# Altium schematic sheet DVT-Discrete-1.SchDoc
size A4
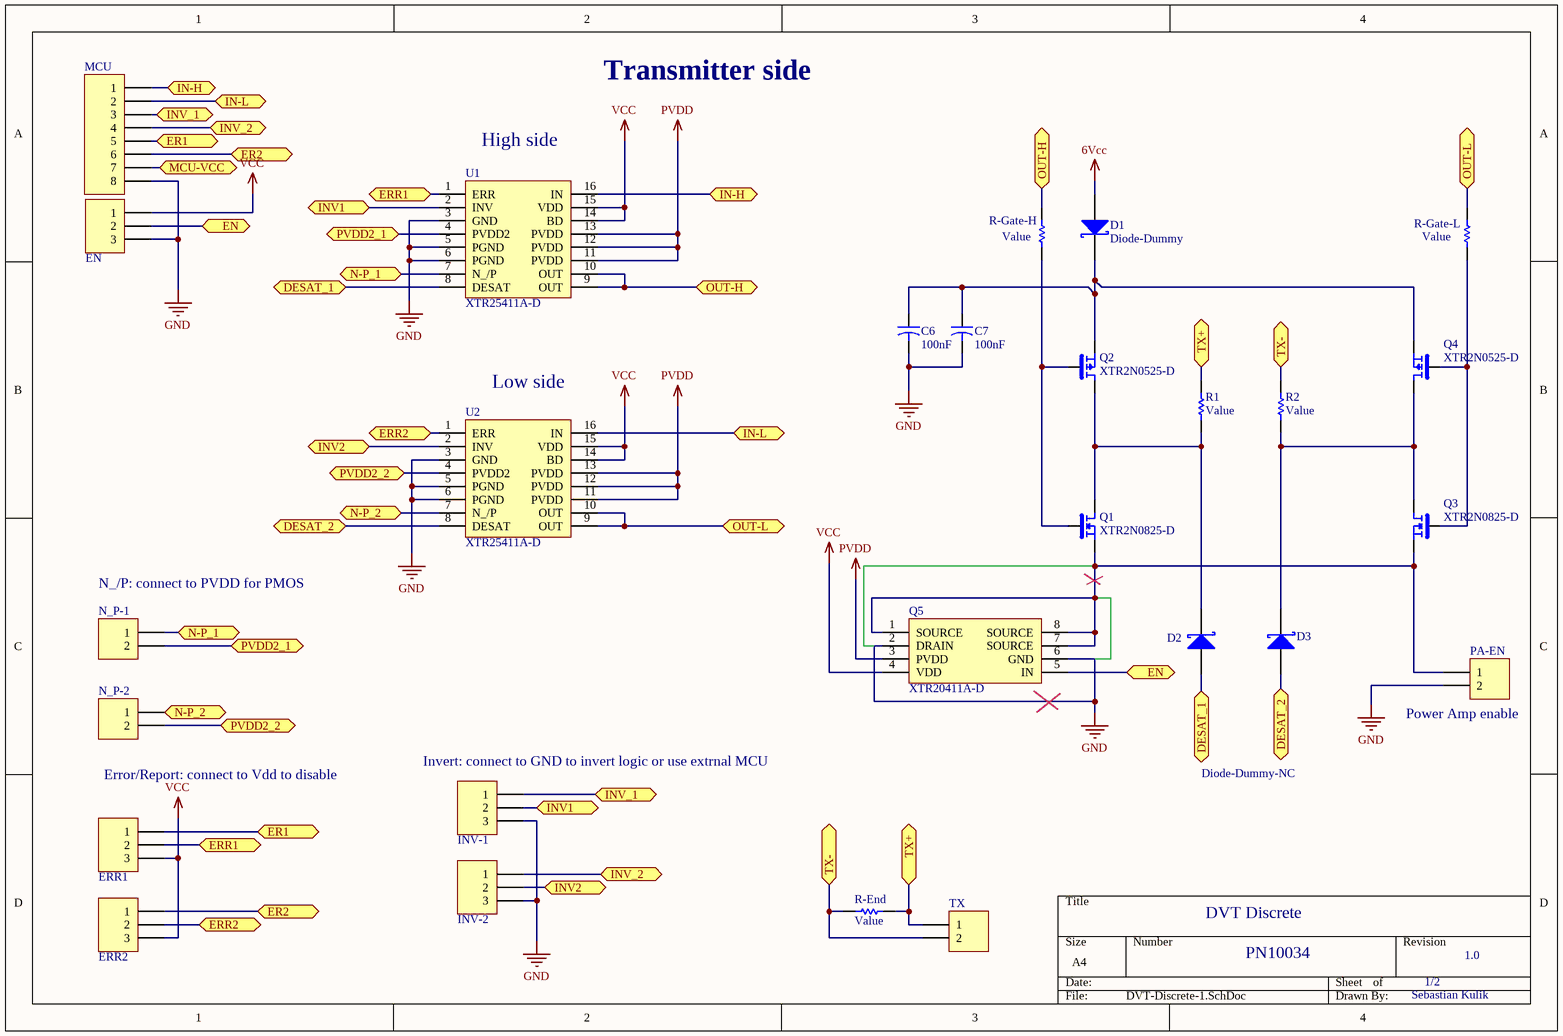
[diagram p0: DVT-Discrete-1.SchDoc]

## Parts
C6  value 100nF  [Dummy-10mm]  (hidden comment: Capacitor-Dummy-THT)
C7  value 100nF  [Dummy-10mm]  (hidden comment: Capacitor-Dummy-THT)
D1  Diode-Dummy  [DO-15-Dummy]
D2  Diode-Dummy-NC  [DO-15-Dummy]
D3  Diode-Dummy  [DO-15-Dummy]  (value not drawn)
EN  Plug_3_90_2.54  [HDR1X3]  (value not drawn)
ERR1  Plug_3_90_2.54  [HDR1X3]  (value not drawn)
ERR2  Plug_3_90_2.54  [HDR1X3]  (value not drawn)
INV-1  Plug_3_90_2.54  [HDR1X3]  (value not drawn)
INV-2  Plug_3_90_2.54  [HDR1X3]  (value not drawn)
MCU  Plug_08_2.54  [HDR1X8_2.54]  (value not drawn)
N_P-1  Plug_2_90_2.54  [HDR1X2]  (value not drawn)
N_P-2  Plug_2_90_2.54  [HDR1X2]  (value not drawn)
PA-EN  Plug_2_90_2.54  [HDR1X2]  (value not drawn)
Q1  XTR2N0825-D  [DIP-8-Ceramic-HT]
Q2  XTR2N0525-D  [DIP-8-Ceramic-HT]
Q3  XTR2N0825-D  [DIP-8-Ceramic-HT]
Q4  XTR2N0525-D  [DIP-8-Ceramic-HT]
Q5  XTR20411A-D  [DIP-8-Ceramic-HT]
R1  Resistor-Dummy-THT  [Dummy-15mm]  (value not drawn)
R2  Resistor-Dummy-THT  [Dummy-15mm]  (value not drawn)
R-End  Resistor-Dummy-THT  [Dummy-10mm]  (value not drawn)
R-Gate-H  Resistor-Dummy-THT  [Dummy-10mm]  (value not drawn)
R-Gate-L  Resistor-Dummy-THT  [Dummy-10mm]  (value not drawn)
TX  PHOENIX_1715721  [Phoenix-2-5_08]  (value not drawn)
U1  XTR25411A-D  [DIP-16-Ceramic-HT]
U2  XTR25411A-D  [DIP-16-Ceramic-HT]

## Ports
DESAT_1, DESAT_2, EN, ER1, ER2, ERR1, ERR2, IN-H, IN-L, INV1, INV2, INV_1, INV_2, MCU-VCC, N-P_1, N-P_2, OUT-H, OUT-L, PVDD2_1, PVDD2_2, TX+, TX-

## Nets
6Vcc: D1.2(A)
GND: C6.2 C7.2 EN.3 INV-1.3 INV-2.3 MCU.8 PA-EN.2 Q5.2(DRAIN) Q5.6(GND) U1.3(GND) U1.5(PGND) U1.6(PGND) U2.3(GND) U2.5(PGND) U2.6(PGND)
PVDD: Q5.3(PVDD) U1.11(PVDD) U1.12(PVDD) U1.13(PVDD) U2.11(PVDD) U2.12(PVDD) U2.13(PVDD)
VCC: EN.1 ERR1.3 ERR2.3 Q5.4(VDD) U1.14(BD) U1.15(VDD) U2.14(BD) U2.15(VDD)
DESAT_1: D2.2(A) U1.8(DESAT) ; port DESAT_1
DESAT_2: D3.2(A) U2.8(DESAT) ; port DESAT_2
EN: EN.2 Q5.5(IN) ; port EN
ER1: ERR1.1 MCU.5 ; port ER1
ER2: ERR2.1 MCU.6 ; port ER2
ERR1: ERR1.2 U1.1(ERR) ; port ERR1
ERR2: ERR2.2 U2.1(ERR) ; port ERR2
IN-H: MCU.1 U1.16(IN) ; port IN-H
IN-L: MCU.2 U2.16(IN) ; port IN-L
INV1: INV-1.2 U1.2(INV) ; port INV1
INV2: INV-2.2 U2.2(INV) ; port INV2
INV_1: INV-1.1 MCU.3 ; port INV_1
INV_2: INV-2.1 MCU.4 ; port INV_2
MCU-VCC: MCU.7 ; port MCU-VCC
N-P_1: N_P-1.1 U1.7(N_/P) ; port N-P_1
N-P_2: N_P-2.1 U2.7(N_/P) ; port N-P_2
OUT-H: R-Gate-H.2 U1.9(OUT) U1.10(OUT) ; port OUT-H
OUT-L: R-Gate-L.2 U2.9(OUT) U2.10(OUT) ; port OUT-L
PVDD2_1: N_P-1.2 U1.4(PVDD2) ; port PVDD2_1
PVDD2_2: N_P-2.2 U2.4(PVDD2) ; port PVDD2_2
TX+: R1.2 R-End.2 TX.1 ; port TX+
TX-: R2.2 R-End.1 TX.2 ; port TX-
NetC6_1: C6.1 C7.1 D1.1(K) Q2.1(Source) Q4.1(Source)
NetD2_1: D2.1(K) Q1.5(Drain) Q2.5(Drain) R1.1
NetD3_1: D3.1(K) Q3.5(Drain) Q4.5(Drain) R2.1
NetPA-EN_1: PA-EN.1 Q1.1(Source) Q3.1(Source) Q5.1(SOURCE) Q5.7(SOURCE) Q5.8(SOURCE)
NetQ1_4: Q1.4(Gate) Q2.4(Gate) R-Gate-H.1
NetQ3_4: Q3.4(Gate) Q4.4(Gate) R-Gate-L.1

## Notes on the sheet
- Transmitter side
- (near U1) High side
- (near U2) Low side
- (near N_P-1) N_/P: connect to PVDD for PMOS
- (near PA-EN) Power Amp enable
- Error/Report: connect to Vdd to disable
- (near INV-1) Invert: connect to GND to invert logic or use extrnal MCU
- DVT Discrete
- PN10034
- 1/2
- 1.0
- Sebastian Kulik

## Library data of the parts
C6 C7 = Capacitor-Dummy-THT: Deliverer PartNr: 699-5027; Manufacturer: AVX; Manufacturer PartNr: SR205E104MARTR; Deliverer: RS; Published: 08.12.2015; Part Description: Capacitor-Dummy-THT; Publisher: Sebastian Kulik; PackageDescription: -; TDE-PN: -
D1-D3 = Diode-Dummy: Manufacturer PartNr: SB5100E-G; Deliverer PartNr: 906-6762; Manufacturer: COMCHIP TECHNOLOGY; Deliverer: RS; Published: 09.12.2015; TDE-PN: -; Publisher: Sebastian Kulik; PackageDescription: DO-201AD
EN = Plug_3_90_2.54: Plug,-3-Pin; Manufacturer PartNr: 61300311021; Manufacturer: WE; Deliverer PartNr: 2356177; Deliverer: Farnell; TDE-PN: CON0011; Publisher: Sebastian Kulik
ERR1 ERR2 INV-1 INV-2 = Plug_3_90_2.54: Plug,-3-Pin; Manufacturer: WE; Manufacturer PartNr: 61300311021; Deliverer PartNr: 2356177; Deliverer: Farnell; TDE-PN: CON0011; Publisher: Sebastian Kulik
MCU = Plug_08_2.54: Plug, 08-Pin; Manufacturer PartNr: 61300811121; Manufacturer: WE; TDE-PN: CON0035; LatestRevisionDate: 11.11.2014; LatestRevisionNote: Re-released for DXP Platform.; Publisher: Sebastian Kulik; Deliverer: WE; Deliverer PartNr: 61300811121
N_P-1 N_P-2 PA-EN = Plug_2_90_2.54: Plug, 2-Pin; Manufacturer PartNr: 61300211021; Manufacturer: WE; Deliverer PartNr: 2356176; Deliverer: Farnell; TDE-PN: CON0010; LatestRevisionDate: 14.05.2014; LatestRevisionNote: Re-released for DXP Platform.; Publisher: Sebastian Kulik
Q1 Q3 = XTR2N0825-D: N-FET, 80V@ 4A; Manufacturer: TI; TDE-PN: DIS0043; Deliverer: ProTEc; Published: 09.12.2015; Publisher: Sebastian Kulik; PackageDescription: DIP-8-Ceramic-HT; Manufacturer PartNr: XTR2N0825-D; Deliverer PartNr: XTR2N0825-D
Q2 Q4 = XTR2N0525-D: P-FET, 50V@ 4A; Manufacturer: TI; TDE-PN: DIS0044; Deliverer: ProTEc; Published: 09.12.2015; Publisher: Sebastian Kulik; PackageDescription: DIP-8-Ceramic-HT; Manufacturer PartNr: XTR2N0525-D; Deliverer PartNr: XTR2N0525-D
Q5 = XTR20411A-D: Gate driver; Manufacturer: X-Rel; TDE-PN: IC0068; Deliverer: ProTec; Published: 08.12.2015; Publisher: Sebastian Kulik; PackageDescription: DIP-8-Ceramic-HT; Manufacturer PartNr: XTR20411A-D; Deliverer PartNr: XTR20411A-D
TX = 2Pol_1715721: Phoenix, 2 pol, 5.08mm, 22A, 715721; Deliverer PartNr: 193-0564; Deliverer: RS; TDE-PN: CON0008; LatestRevisionDate: 02.05.2014; LatestRevisionNote: Re-released for DXP Platform.; Publisher: Sebastian Kulik; Manufacturer PartNr: 1715721; Manufacturer: Phoenix; PackageDescription: Phoenix-2-5_08
U1 U2 = XTR25411A-D: Gate driver; Manufacturer: X-Rel; Deliverer: ProTec; TDE-PN: IC0067; Published: 08.12.2015; Deliverer PartNr: XTR25411A-D; PackageDescription: DIP-16-Ceramic-HT; Publisher: Sebastian Kulik; Manufacturer PartNr: XTR25411A-D
R1 R2 R-End R-Gate-H R-Gate-L = Resistor-Dummy-THT: Published: 08.12.2015; Publisher: Sebastian Kulik; PackageDescription: -; Manufacturer: -; Manufacturer PartNr: -; TDE-PN: -; Deliverer PartNr: -; Deliverer: -; Part Desicription: Resistor-Dummy-THT; Value: Value